# EAGLE design charger_pcb (EAGLE 6.5.0)
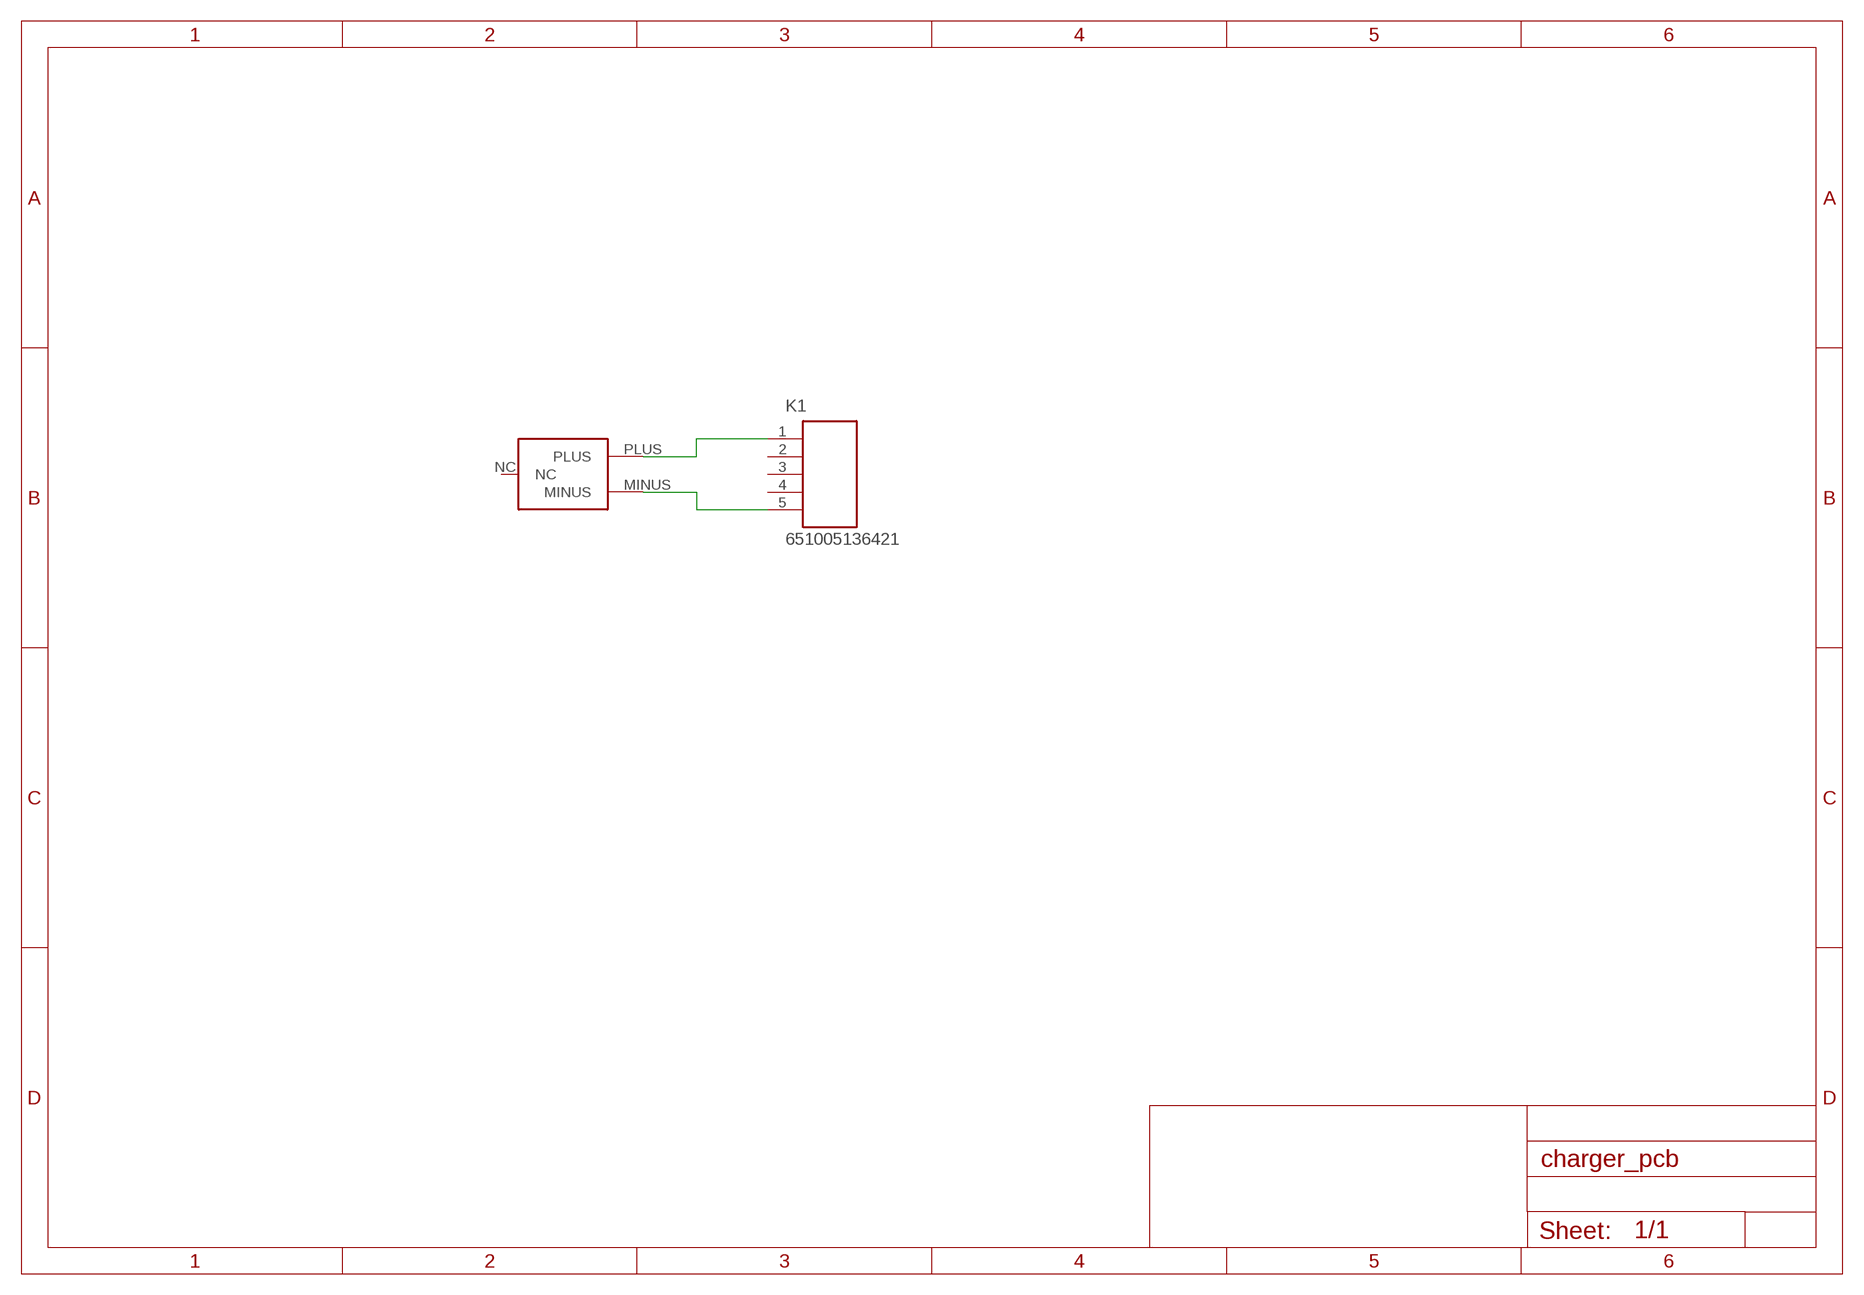
[diagram p0: schematic, sheet 1]

## Parts
K1  651005136421  [651005136421]
X2  CHGOUTSMD  [CHGOUTSMD]

## Nets
N$1: K1.1 X2.PLUS
N$2: K1.5 X2.MINUS
Unconnected: K1.2 K1.3 K1.4 X2.NC

## Library data of the parts
K1 = USBSteckverbinderWR-COM:651005136421: WR-COM Vertical 5 Contacts Mini USB Type B, 5 pins=>Code : Con_I-O_COM_MiniUSB_651005136421 <http://katalog.we-online.de/media/images/eican/Con_I-O_COM_MiniUSB_651005136421_pf2.jpg> Details see: http://katalog.we-online.de/en/em/651_005_136_421 Created 2014-07-09, Karrer Zheng 2014 (C) Würth Elektronik
X2 = stefanbib:CHGOUT

## Board
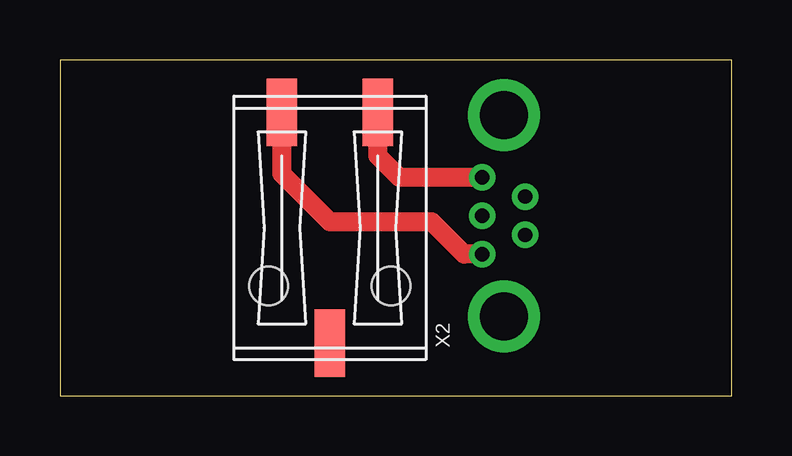
[diagram p1: board, top side]
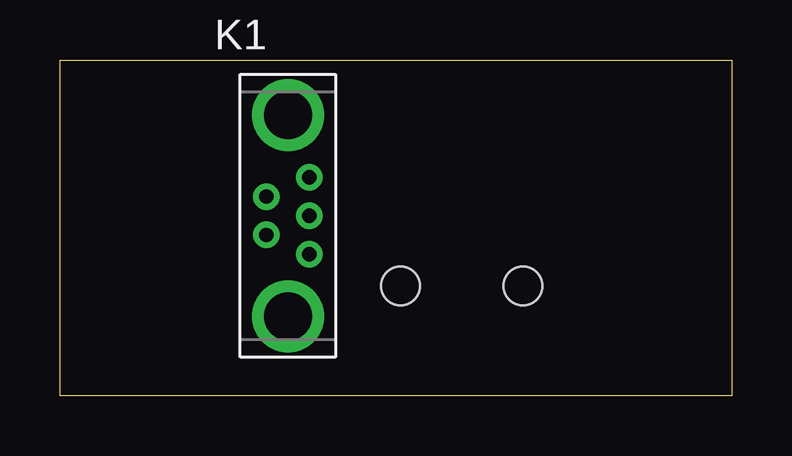
[diagram p2: board, bottom side, seen from below]

Size 28 x 14 mm. Coordinates in mm from the lower left corner, seen from the top.
Outline: 0,0 28,0 28,14 0,14 0,0
Copper layers (1*16): Top 0.035mm / dielectric 1.5mm / Bottom 0.035mm
Design rules "default": minimum track width 10mil, minimum drill 24mil, track to track 8mil, track to pad 8mil, pad to pad 8mil, via to via 8mil, smd to smd 8mil, copper to edge 40mil, drill to drill 8mil, minimum pad ring 10mil, minimum via ring 8mil, stop-mask expansion 4mil, vias tented up to drill 0mil, thermal gap 10mil
tRestrict: area 21.5,5 to 27.5,11; area 0.5,5 to 6.5,11

### Footprints (pad centres in the part's own frame; a part is rotated, then mirrored left to right if it is on the bottom)
651005136421 = drill 0.6: 1 0.9,-1.6; 2 -0.9,-0.8; 3 0.9,0; 4 -0.9,0.8; 5 0.9,1.6 | drill 2: Z1 0,4.2; Z2 0,-4.2
CHGOUTSMD = smd 2.8 x 1.27: MINUS 4.81,-2; NC -4.81,0; PLUS 4.81,2 | hole 1.6: -2.43,2.555; -2.43,-2.555

### Placement (x,y rotation side)
K1  18.5,7.5 0 bottom
X2  11.25,7 90 top

### Tracks (layer width: path | path; a pad name or v marks a point on that pad's centre or on a via)
N$1
  Top 0.8: K1.1 16.85,5.9 15.5,7.25 11.25,7.25 9.25,9.25 X2.PLUS
N$2
  Top 0.8: K1.5 14.15,9.1 13.25,10 X2.MINUS